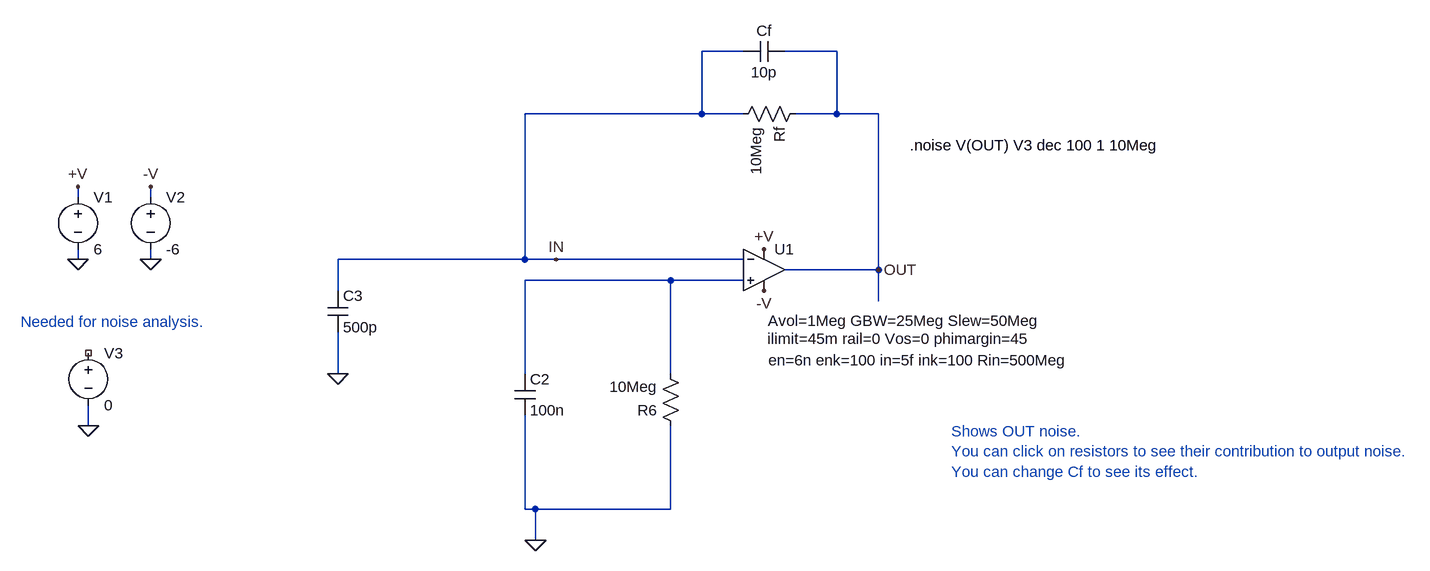
[diagram p0: schematic Universal_TIA.asc]
Universal_TIA.asc, the LTspice schematic file:
Version 4
SHEET 1 1696 700
WIRE 544 -1440 480 -1440
WIRE 688 -1440 608 -1440
WIRE 480 -1344 480 -1440
WIRE 480 -1344 208 -1344
WIRE 544 -1344 480 -1344
WIRE 688 -1344 688 -1440
WIRE 688 -1344 624 -1344
WIRE 752 -1344 688 -1344
WIRE -480 -1216 -480 -1232
WIRE -368 -1216 -368 -1232
WIRE -480 -1120 -480 -1136
WIRE -368 -1120 -368 -1136
WIRE 208 -1120 208 -1344
WIRE 208 -1120 -80 -1120
WIRE 256 -1120 208 -1120
WIRE 544 -1120 256 -1120
WIRE 752 -1104 752 -1344
WIRE 752 -1104 608 -1104
WIRE 432 -1088 208 -1088
WIRE 544 -1088 432 -1088
WIRE -80 -1072 -80 -1120
WIRE 752 -1056 752 -1104
WIRE -80 -944 -80 -1008
WIRE 208 -944 208 -1088
WIRE 432 -944 432 -1088
WIRE -464 -864 -464 -896
WIRE 208 -736 208 -880
WIRE 224 -736 208 -736
WIRE 432 -736 432 -864
WIRE 432 -736 224 -736
WIRE 224 -688 224 -736
FLAG -480 -1232 +V
FLAG -480 -1120 0
FLAG 752 -1104 OUT
FLAG 576 -1136 +V
FLAG -368 -1232 -V
FLAG 576 -1072 -V
FLAG -368 -1120 0
FLAG 256 -1120 IN
FLAG 224 -688 0
FLAG -464 -864 0
FLAG -80 -944 0
SYMBOL voltage -480 -1232 R0
WINDOW 123 0 0 Left 2
WINDOW 39 0 0 Left 2
SYMATTR InstName V1
SYMATTR Value 6
SYMBOL voltage -368 -1232 R0
WINDOW 123 24 146 Left 2
WINDOW 39 24 125 Left 2
SYMATTR InstName V2
SYMATTR Value -6
SYMBOL Opamps\\UniversalOpamp2 576 -1104 R0
WINDOW 123 6 78 Left 2
WINDOW 39 5 106 Left 2
WINDOW 40 7 139 Left 2
SYMATTR Value2 Avol=1Meg GBW=25Meg Slew=50Meg
SYMATTR SpiceLine ilimit=45m rail=0 Vos=0 phimargin=45
SYMATTR SpiceLine2 en=6n enk=100 in=5f ink=100 Rin=500Meg
SYMATTR InstName U1
SYMBOL res 640 -1360 R90
WINDOW 123 35 107 Left 2
SYMATTR InstName Rf
SYMATTR Value 10Meg
SYMBOL cap 608 -1456 R90
WINDOW 0 0 32 VBottom 2
WINDOW 3 32 32 VTop 2
SYMATTR InstName Cf
SYMATTR Value 10p
SYMBOL res 448 -848 R180
WINDOW 123 35 107 Left 2
SYMATTR InstName R6
SYMATTR Value 10Meg
SYMBOL cap 192 -944 R0
SYMATTR InstName C2
SYMATTR Value 100n
SYMBOL voltage -464 -992 R0
WINDOW 123 0 0 Left 0
WINDOW 39 0 0 Left 0
SYMATTR InstName V3
SYMATTR Value 0
SYMBOL cap -96 -1072 R0
SYMATTR InstName C3
SYMATTR Value 500p
TEXT 800 -1296 Left 2 !.noise V(OUT) V3 dec 100 1 10Meg
TEXT -568 -1024 Left 2 ;Needed for noise analysis.
TEXT 864 -856 Left 2 ;Shows OUT noise.\nYou can click on resistors to see their contribution to output noise.\nYou can change Cf to see its effect.

The netlist it stands for:
* Universal_TIA.asc
V1 +V 0 6
V2 -V 0 -6
XU1 N001 IN +V -V OUT level.2 Avol=1Meg GBW=25Meg Slew=50Meg ilimit=45m rail=0 Vos=0 phimargin=45 en=6n enk=100 in=5f ink=100 Rin=500Meg  ; pins IN+ IN- V+ V- OUT
Rf OUT IN 10Meg
Cf OUT IN 10p
R6 0 N001 10Meg
C2 N001 0 100n
V3 NC_01 0 0
C3 IN 0 500p
.noise V(OUT) V3 dec 100 1 10Meg
* Needed for noise analysis.
* Shows OUT noise.
* You can click on resistors to see their contribution to output noise.
* You can change Cf to see its effect.
.lib UniversalOpamps2.sub
.backanno
.end